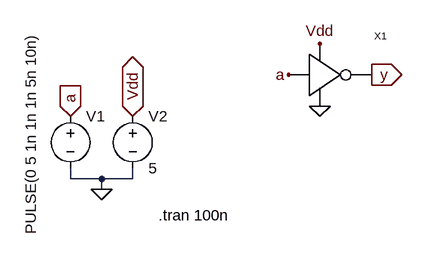
[diagram p0: schematic notsim.asc]
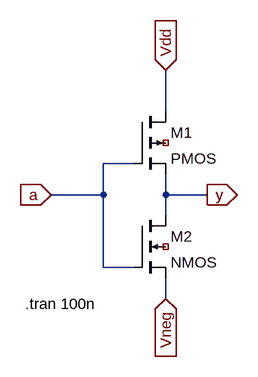
[diagram p1: sub-circuit notsymb.asc]
notsim.asc, the LTspice schematic file:
Version 4
SHEET 1 880 680
WIRE 208 304 208 288
WIRE 256 304 208 304
WIRE 304 304 304 288
WIRE 304 304 256 304
WIRE 256 320 256 304
FLAG 208 208 a
IOPIN 208 208 In
FLAG 304 208 Vdd
IOPIN 304 208 BiDir
FLAG 256 320 0
FLAG 544 144 a
FLAG 592 96 Vdd
FLAG 592 192 0
FLAG 672 144 y
IOPIN 672 144 Out
SYMBOL voltage 208 192 R0
WINDOW 3 -61 -113 VRight 2
SYMATTR Value PULSE(0 5 1n 1n 1n 5n 10n)
SYMATTR InstName V1
SYMBOL voltage 304 192 R0
SYMATTR InstName V2
SYMATTR Value 5
SYMBOL notsymb 608 144 R0
SYMATTR InstName X1
TEXT 344 360 Left 2 !.tran 100n

notsymb.asc, the sub-circuit schematic file:
Version 4
SHEET 1 880 680
WIRE 560 64 560 0
WIRE 512 144 464 144
WIRE 464 192 464 144
WIRE 464 192 384 192
WIRE 560 192 560 160
WIRE 624 192 560 192
WIRE 560 224 560 192
WIRE 464 304 464 192
WIRE 512 304 464 304
WIRE 560 352 560 320
FLAG 384 192 a
IOPIN 384 192 In
FLAG 560 0 Vdd
IOPIN 560 0 In
FLAG 560 352 Vneg
IOPIN 560 352 In
FLAG 624 192 y
IOPIN 624 192 Out
FLAG 624 192 y
IOPIN 624 192 Out
SYMBOL pmos4 512 64 R0
SYMATTR InstName M1
SYMBOL nmos4 512 224 R0
SYMATTR InstName M2
TEXT 344 360 Left 2 !.tran 100n

The netlist it stands for:
* notsim.asc
V1 a 0 PULSE(0 5 1n 1n 1n 5n 10n)
V2 Vdd 0 5
XX1 a Vdd 0 y notsymb

* block symbol definitions
.subckt notsymb a Vdd Vneg y
M1 Vdd a y NC_01 PMOS
M2 y a Vneg NC_02 NMOS
.tran 100n
.ends notsymb

.model NMOS NMOS
.model PMOS PMOS
.lib standard.mos
.tran 100n
.backanno
.end